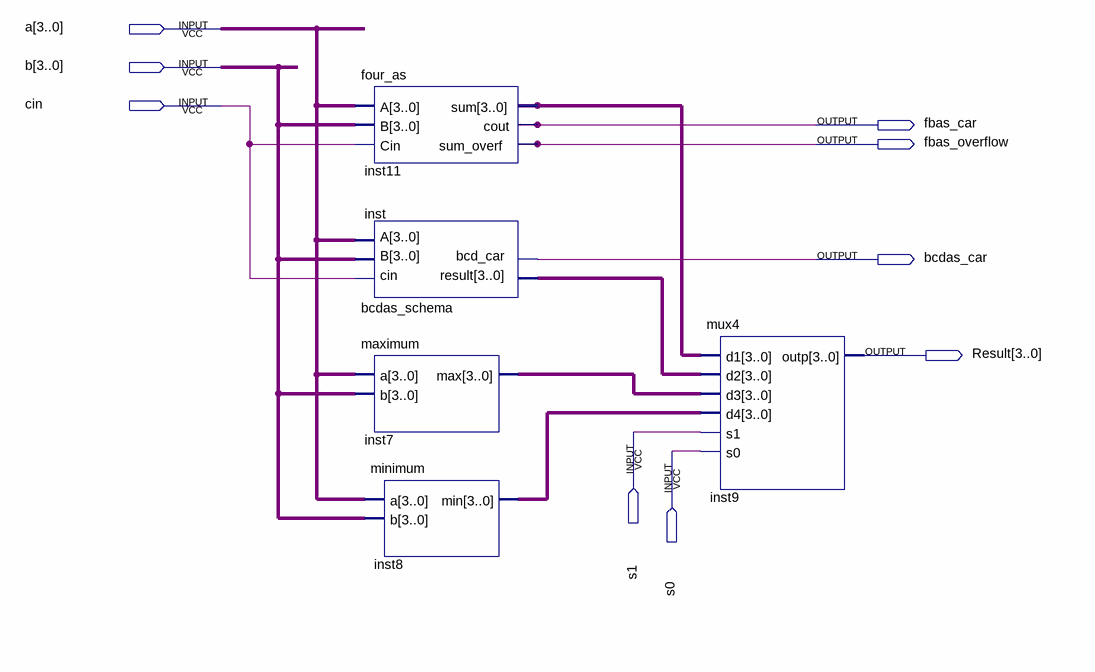
[diagram p0: schematic sheet]
// Quartus schematic w_system.bdf as structural Verilog: 5 symbols, 9 pins
module w_system (
  input  [3:0] a,
  input  [3:0] b,
  input  cin,
  input  s1,
  input  s0,
  output fbas_car,
  output fbas_overflow,
  output bcdas_car,
  output [3:0] Result
);

  wire [3:0] inst7_max, inst8_min, inst11_sum, inst_result;

  four_as inst11 (.A(a), .B(b), .Cin(cin), .sum(inst11_sum), .cout(fbas_car), .sum_overf(fbas_overflow));
  bcdas_schema inst (.cin(cin), .B(b), .A(a), .result(inst_result), .bcd_car(bcdas_car));
  maximum inst7 (.a(a), .b(b), .max(inst7_max));
  minimum inst8 (.a(a), .b(b), .min(inst8_min));
  mux4 inst9 (.d1(inst11_sum), .d2(inst_result), .d3(inst7_max), .d4(inst8_min), .s1(s1), .s0(s0), .outp(Result));
endmodule
